# EAGLE design StartStopSwitch_Ver3_0 (EAGLE 9.6.2)
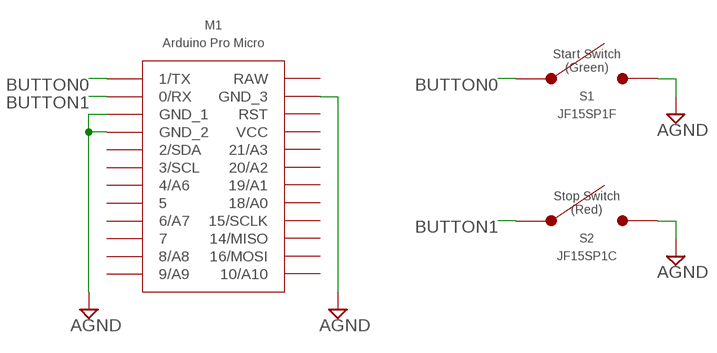
[diagram p0: schematic, sheet 1]

## Parts
M1  PRO_MICRO_SMD  [PRO_MICRO_SMD]
S1  JF15SP1F  [JF15SP1]
S2  JF15SP1C  [JF15SP1]

## Nets
AGND: M1.3(GND_1) M1.4(GND_2) M1.23(GND_3) S1.3 S1.4 S2.3 S2.4
BUTTON0: M1.1(1/TX) S1.1 S1.2
BUTTON1: M1.2(0/RX) S2.1 S2.2
Unconnected: M1.5(2/SDA) M1.6(3/SCL) M1.7(4/A6) M1.8 M1.9(6/A7) M1.10 M1.11(8/A8) M1.12(9/A9) M1.13(10/A10) M1.14(16/MOSI) M1.15(14/MISO) M1.16(15/SCLK) M1.17(18/A0) M1.18(19/A1) M1.19(20/A2) M1.20(21/A3) M1.21(VCC) M1.22(RST) M1.24(RAW)

## Notes on the sheet
- Start Switch
  (Green)
- Stop Switch
  (Red)

## Library data of the parts
M1 = Arduino:PRO_MICRO_SMD
S1 = NKK Switches:JF15SP1F
S2 = NKK Switches:JF15SP1C

## Net classes
0 default: width 0.254 mm, drill 0.254 mm, clearance 0.254 mm

## Board
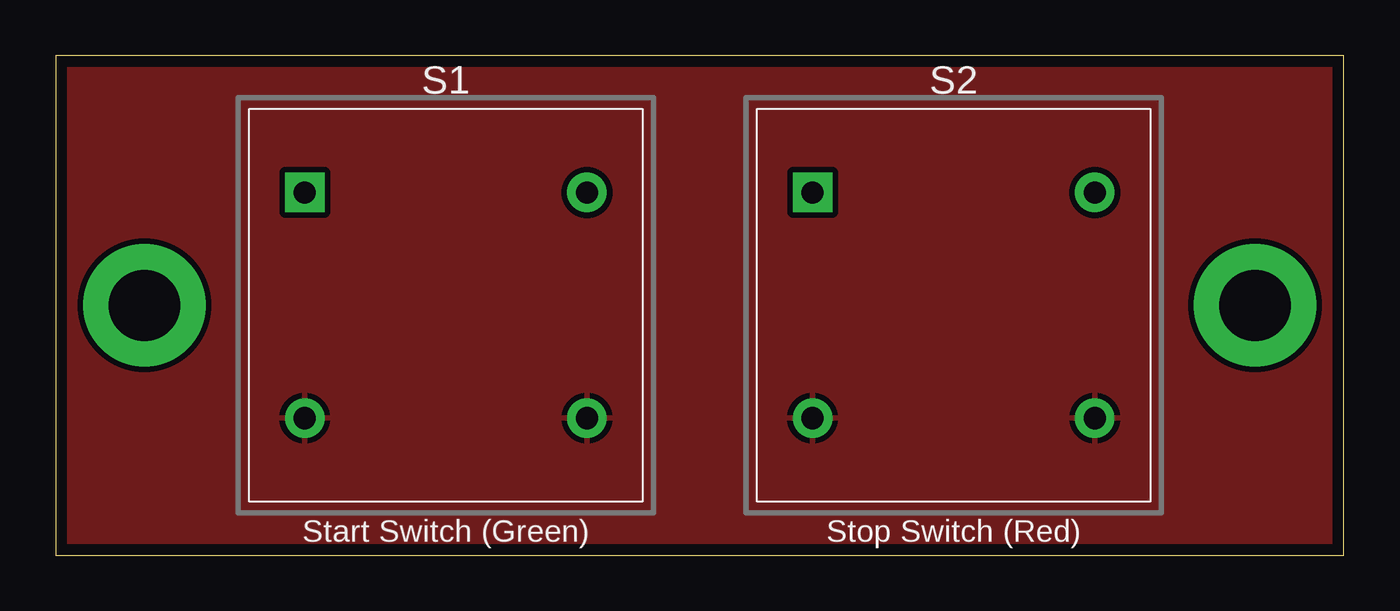
[diagram p1: board, top side]
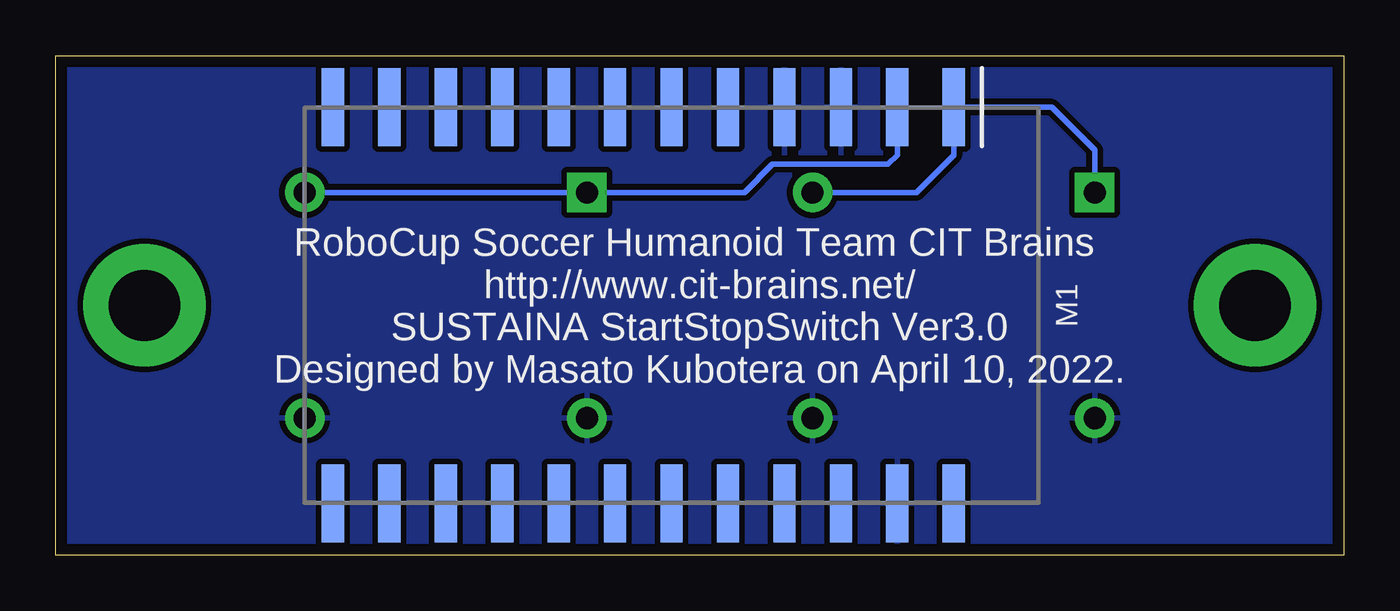
[diagram p2: board, bottom side, seen from below]

Size 58 x 22.5 mm. Coordinates in mm from the lower left corner, seen from the top.
Outline: 0,0 58,0 58,22.5 0,22.5 0,0
Copper layers (1*16): Top 0.035mm / dielectric 1.6mm / Bottom 0.035mm
Design rules "Elecrow_2-layer_PCB_eagle_rule *": minimum track width 6mil, minimum drill 12mil, track to track 6mil, track to pad 6mil, pad to pad 6mil, via to via 8mil, smd to smd 0mil, copper to edge 20mil, drill to drill 10mil, minimum pad ring 6mil, minimum via ring 6mil, stop-mask expansion 0mil, vias tented up to drill 100mil, thermal gap 10mil

### Footprints (pad centres in the part's own frame; a part is rotated, then mirrored left to right if it is on the bottom)
PRO_MICRO_SMD = smd 3.5 x 1: 1 -8.92,13.97; 2 -8.92,11.43; 3 -8.92,8.89; 4 -8.92,6.35; 5 -8.92,3.81; 6 -8.92,1.27; 7 -8.92,-1.27; 8 -8.92,-3.81; 9 -8.92,-6.35; 10 -8.92,-8.89; 11 -8.92,-11.43; 12 -8.92,-13.97; 13 8.92,-13.97; 14 8.92,-11.43; 15 8.92,-8.89; 16 8.92,-6.35; 17 8.92,-3.81; 18 8.92,-1.27; 19 8.92,1.27; 20 8.92,3.81; 21 8.92,6.35; 22 8.92,8.89; 23 8.92,11.43; 24 8.92,13.97
JF15SP1 = drill 1 pad 1.778 square: 1 5.08,6.35 | drill 1 pad 1.778: 2 5.08,-6.35; 3 -5.08,6.35; 4 -5.08,-6.35

### Placement (x,y rotation side)
M1  31.54,11.25 270 bottom
S1  17.57,11.25 90 top
S2  40.43,11.25 90 top

### Tracks (layer width: path | path; a pad name or v marks a point on that pad's centre or on a via)
AGND
  pour Top: -2.75,23.95 -2.75,-1.45 60.75,-1.45 60.75,23.95
  pour Bottom: -2.75,23.95 -2.75,-1.45 60.75,-1.45 60.75,23.95
BUTTON0
  Bottom 0.254: S1.1 11.22,18.23 13.15,20.17 M1.1 17.57,18.02 19.26,16.33 S1.2
BUTTON1
  Bottom 0.254: M1.2 20.11,18.02 20.53,17.6 25.72,17.6 26.99,16.33 S2.1 S2.2
SCREW_HOLE1  (via drill 3.2 pad 5.5)
  other vias: 4,11.25
SCREW_HOLE2  (via drill 3.2 pad 5.5)
  other vias: 54,11.25

### Text on the board
tPlace: Start Switch (Green) | Stop Switch (Red)
bPlace: RoboCup Soccer Humanoid Team CIT Brains / http://www.cit-brains.net/ / SUSTAINA StartStopSwitch Ver3.0 / Designed by Masato Kubotera on April 10, 2022.